# Altium schematic sheet 电源模块.SchDoc
size A4; DocumentNumber: 2; SheetNumber: 2; SheetTotal: 8
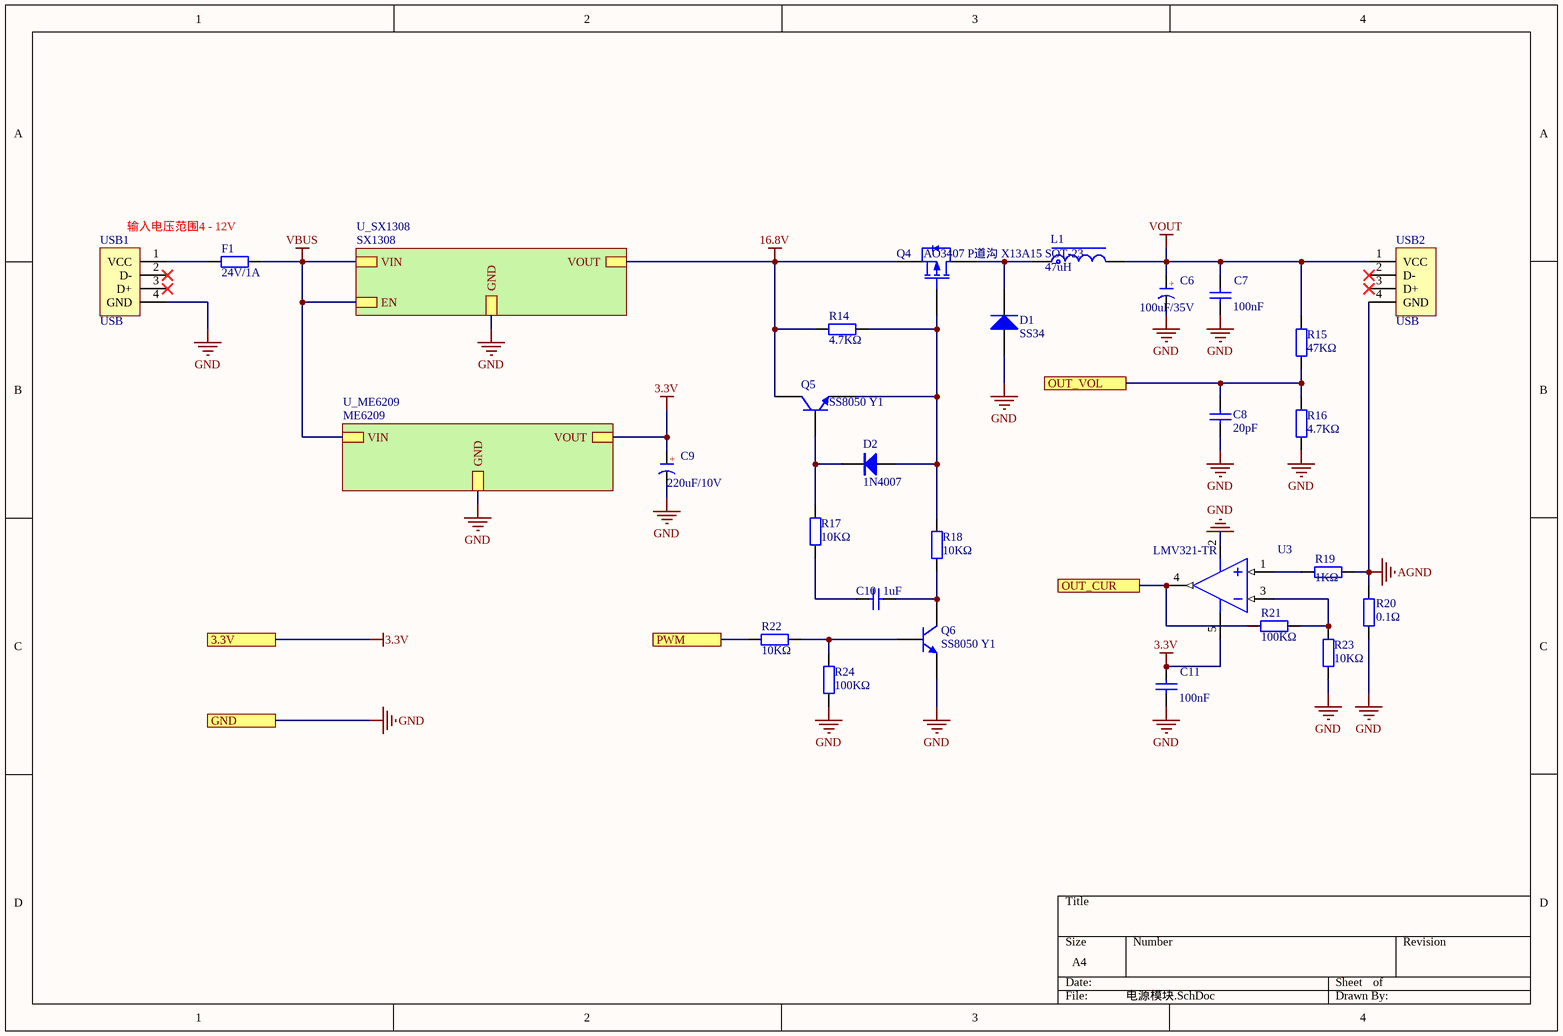
[diagram p0: 电源模块.SchDoc]

## Parts
C6  100uF/35V  [CAP 2.5*6.3*11.2-H]
C7  100nF  [LC-0603_C]
C8  20pF  [LC-0603_C]
C9  220uF/10V  [CAP 2.0*5*11-H]
C10  1uF  [LC-0603_C]
C11  100nF  [LC-0603_C]
D1  SS34  [LC-SMA(DO-214AC)_S1]
D2  1N4007  [SOD-323]
F1  value 24V/1A  [1206]  (hidden comment: MF-NSMF020-2 0.2A 24V)
L1  47uH  [CDRH73]
Q4  AO3407 P道沟 X13A15 SOT-23  [LC-SOT-23(SOT-23-3)]
Q5  SS8050 Y1  [LC-SOT-23(SOT-23-3)]
Q6  SS8050 Y1  [LC-SOT-23(SOT-23-3)]
R14  4.7KΩ  [LC-0603_R]
R15  47KΩ  [LC-0603_R]
R16  4.7KΩ  [LC-0603_R]
R17  10KΩ  [LC-0603_R]
R18  10KΩ  [LC-0603_R]
R19  1KΩ  [LC-0603_R]
R20  0.1Ω  [R 2512_L]
R21  100KΩ  [LC-0603_R]
R22  10KΩ  [LC-0603_R]
R23  10KΩ  [LC-0603_R]
R24  100KΩ  [LC-0603_R]
U3  LMV321-TR  [LC-SOT-23-5]
USB1  USB  [USB_A/P_A]
USB2  USB  [USB-A/S_A]

## Sub-sheets
U_ME6209 = ME6209: VOUT, VIN, GND
U_SX1308 = SX1308: VIN, EN, GND, VOUT

## Ports
3.3V, GND, OUT_CUR, OUT_VOL, PWM

## Nets
3.3V: C9.1(A) C11.2 U3.5(V+) ; port 3.3V, sheet U_ME6209/VOUT
16.8V: Q4.2(S) Q5.3(C) R14.2 ; sheet U_SX1308/VOUT
AGND: R19.1 R20.2 USB2.4(GND)
GND: C6.2(K) C7.1 C8.1 C9.2(K) C11.1 D1.1(A) Q6.2(E) R16.1 R20.1 R23.2 R24.2 U3.2(V-) USB1.4(GND) ; port GND, sheet U_SX1308/GND, sheet U_ME6209/GND
VBUS: F1.2 ; sheet U_SX1308/VIN, sheet U_SX1308/EN, sheet U_ME6209/VIN
VOUT: C6.1(A) C7.2 L1.2 R15.2 USB2.1(VCC)
OUT_CUR: R21.2 U3.4(OUT) ; port OUT_CUR
OUT_VOL: C8.2 R15.1 R16.2 ; port OUT_VOL
PWM: R22.2 ; port PWM
NetC10_1: C10.1 R17.1
NetC10_2: C10.2 Q6.3(C) R18.1
NetD1_2: D1.2(K) L1.1 Q4.3(D)
NetD2_1: D2.1(A) Q4.1(G) Q5.2(E) R14.1 R18.2
NetD2_2: D2.2(K) Q5.1(B) R17.2
NetF1_1: F1.1 USB1.1(VCC)
NetQ6_1: Q6.1(B) R22.1 R24.1
NetR19_2: R19.2 U3.1(IN+)
NetR21_1: R21.1 R23.1 U3.3(IN-)

Not connected (* = marked no-connect by the designer): USB1 2(D-)* 3(D+)*; USB2 2(D-)* 3(D+)*

## Notes on the sheet
- 输入电压范围4 - 12V
- (in symbol CE) +

## Library data of the parts
C6 C9 = CE: 直插电解电容; 淘宝ID: 封装库来自淘宝 ID：黄晶宝石; BOM名称: 直插电解电容; 联系售后: https://shop463601444.taobao.com
C7 C11 = 0603 100nF (104) 10% 50V: 贴片电容; ComponentLink1Description: 供应商链接; ComponentLink1URL: http://www.szlcsc.com/product/details_15331.html; Package: 0603; Supplier: LC; SuppliersPartNumber: C14663
C8 = 0603 20pF (200) 5% 50V: 贴片电容; ComponentLink1Description: 供应商链接; ComponentLink1URL: http://www.szlcsc.com/product/details_2000.html; Package: 0603; Supplier: LC; SuppliersPartNumber: C1648
C10 = 0603 1uF (105) 10% 50V: 贴片电容; ComponentLink1Description: 供应商链接; ComponentLink1URL: http://www.szlcsc.com/product/details_16531.html; Package: 0603; Supplier: LC; SuppliersPartNumber: C15849
D1 = SMA(DO-214AC) SS54: 二极管; ComponentLink1Description: 供应商链接; ComponentLink1URL: http://www.szlcsc.com/product/details_23178.html; Package: SMA(DO-214AC); Supplier: LC; SuppliersPartNumber: C22452
D2 = 1N4148: 开关二极管; BOM名称: 高速开关二极管; 淘宝ID: 封装库来自淘宝 ID：黄晶宝石; 欢迎光临: https://shop463601444.taobao.com
F1 = MF-NSMF020-2 0.2A 24V: 自恢复保险丝; Published: 8-Jun-2000; LatestRevisionDate: 17-Jul-2002; LatestRevisionNote: Re-released for DXP Platform.; PackageReference: AXIAL-0.4; Publisher: Altium Limited
L1 = L-CDRH: 功率屏蔽电感; 版权归属: 封装库来自淘宝 ID：黄晶宝石; BOM名称: 功率屏蔽电感; 联系售后: https://shop463601444.taobao.com
Q4 = AO3401A P道沟 X13A15 SOT-23: MOS(场效应管); ComponentLink1Description: 供应商链接; ComponentLink1URL: http://www.szlcsc.com/product/details_15801.html; Package: SOT-23; Supplier: LC; SuppliersPartNumber: C15127
Q5 Q6 = SOT-23 SS8050 Y1: 三极管; ComponentLink1Description: 供应商链接; ComponentLink1URL: http://www.szlcsc.com/product/details_2507.html; Package: SOT-23; Supplier: LC; SuppliersPartNumber: C2150
R14 = 0603 4.7KΩ (4701) 1%: 贴片电阻; ComponentLink1Description: 供应商链接; ComponentLink1URL: http://www.szlcsc.com/product/details_23889.html; Package: 0603; Supplier: LC; SuppliersPartNumber: C23162
R15 R21 R24 = 0603 100KΩ (1003) 1%: 贴片电阻; ComponentLink1Description: 供应商链接; ComponentLink1URL: http://www.szlcsc.com/product/details_26546.html; Package: 0603; Supplier: LC; SuppliersPartNumber: C25803
R16-R18 R22 R23 = 0603 10KΩ (1002) 1%: 贴片电阻; ComponentLink1Description: 供应商链接; ComponentLink1URL: http://www.szlcsc.com/product/details_26547.html; Package: 0603; Supplier: LC; SuppliersPartNumber: C25804
R19 = 0603 1KΩ (1001) 1%: 贴片电阻; ComponentLink1Description: 供应商链接; ComponentLink1URL: http://www.szlcsc.com/product/details_21904.html; Package: 0603; Supplier: LC; SuppliersPartNumber: C21190
R20 = R: 贴片电阻; 版权归属: 来自淘宝 ID：黄晶宝石; 封装库来自淘宝卖家 ID：黄晶宝石: 其他店铺购入均为盗版，不享受售后技术支持服务，请立即申请退款; BOM名称: 贴片电阻; 联系售后: https://shop463601444.taobao.com
U3 = LMV321IDBVRG4: 运放; ComponentLink1Description: 供应商链接; ComponentLink1URL: http://www.szlcsc.com/product/details_8449.html; Package: SOT-23-5; Supplier: LC; SuppliersPartNumber: C7972
USB1 = USB-A/P: USB-A型公接口; 版权归属: 封装库来自淘宝卖家 ID：黄晶宝石; BOM名称: USB-A型公接口; 学习资源: https://shop463601444.taobao.com
USB2 = USB-A/S: USB-A型母接口; 版权归属: 封装库来自淘宝 ID：黄晶宝石; BOM名称: USB-A型母接口; 学习资源: https://shop463601444.taobao.com